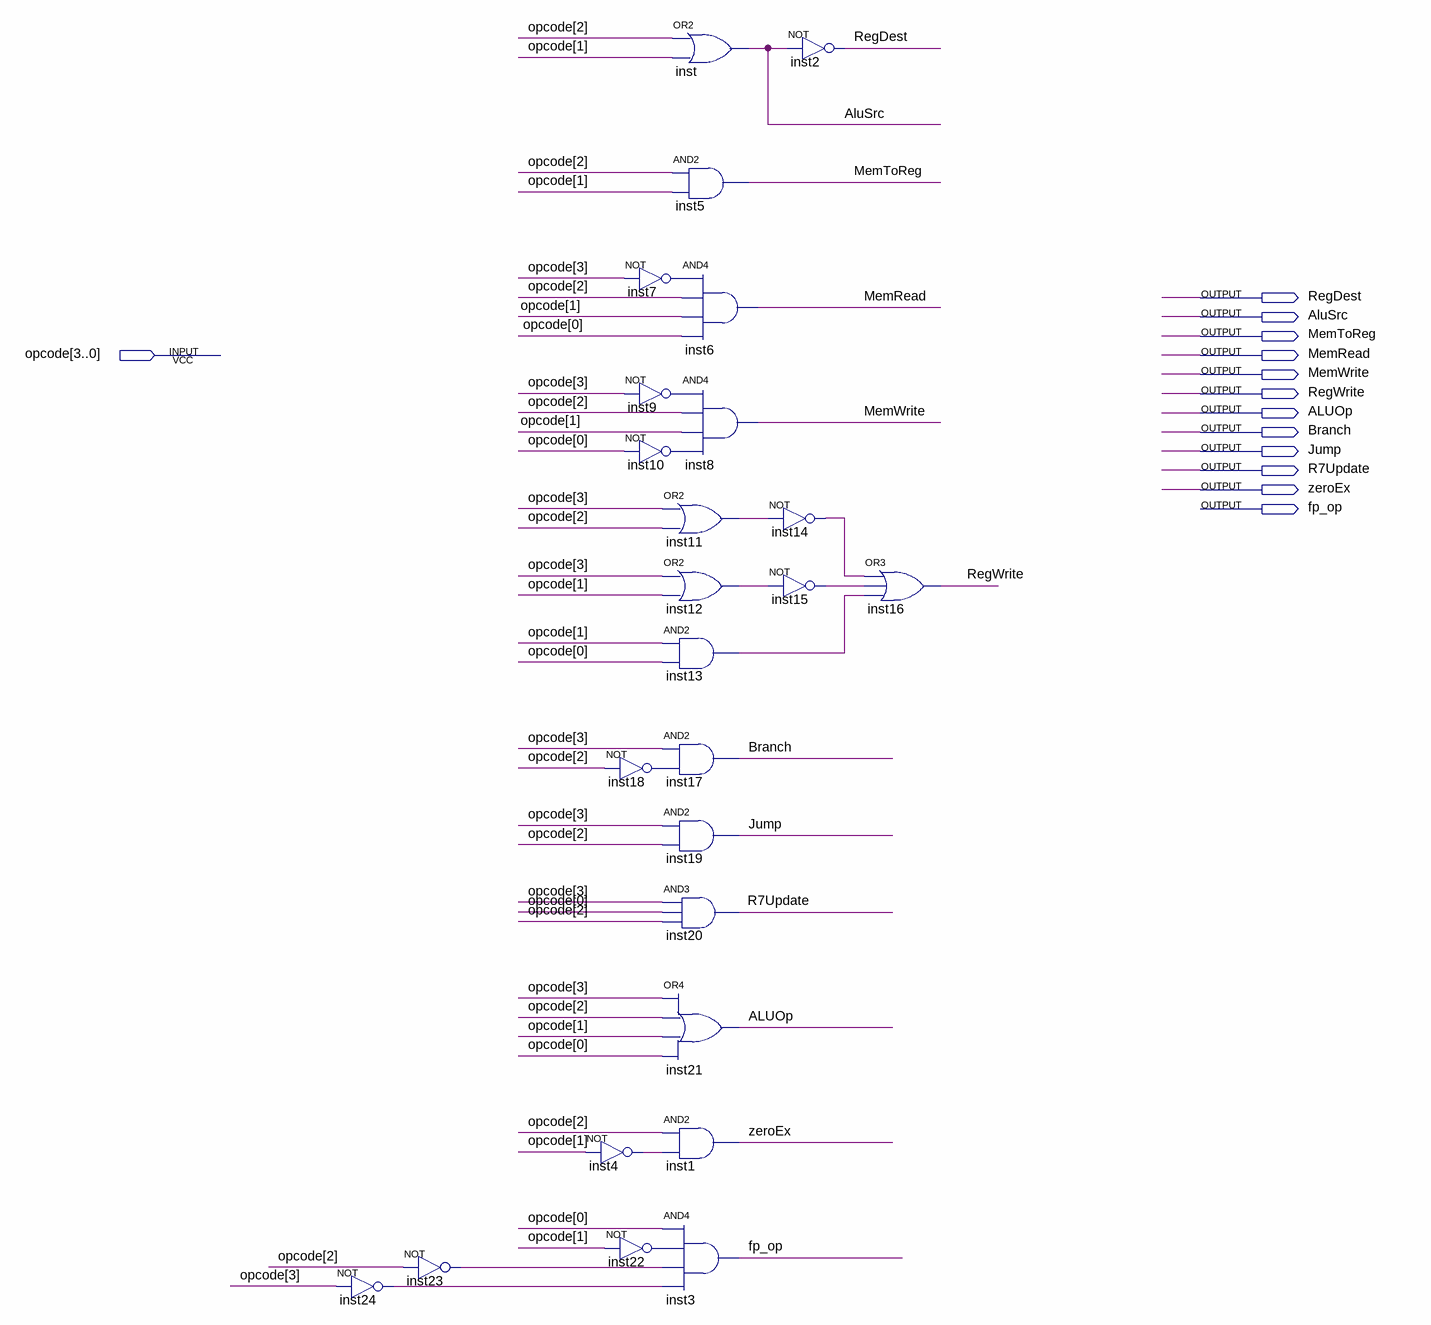
[diagram p0: schematic sheet]
// Quartus schematic main_control.bdf as structural Verilog: 25 symbols, 13 pins
module main_control (
  input  [3:0] opcode,
  output RegDest,
  output AluSrc,
  output MemToReg,
  output MemRead,
  output MemWrite,
  output RegWrite,
  output ALUOp,
  output Branch,
  output Jump,
  output R7Update,
  output zeroEx,
  output fp_op
);

  wire inst4_out, inst7_out, inst9_out, inst10_out, inst11_out, inst12_out, inst13_out, inst14_out,
       inst15_out, inst18_out, inst22_out, inst23_out, inst24_out;

  not inst24 (inst24_out, opcode[3]);
  not inst23 (inst23_out, opcode[2]);
  not inst7 (inst7_out, opcode[3]);
  not inst9 (inst9_out, opcode[3]);
  not inst10 (inst10_out, opcode[0]);
  not inst18 (inst18_out, opcode[2]);
  not inst4 (inst4_out, opcode[1]);
  not inst22 (inst22_out, opcode[1]);
  or inst (AluSrc, opcode[2], opcode[1]);
  and inst5 (MemToReg, opcode[2], opcode[1]);
  and inst6 (MemRead, inst7_out, opcode[2], opcode[1], opcode[0]);
  and inst8 (MemWrite, inst9_out, opcode[2], opcode[1], inst10_out);
  or inst11 (inst11_out, opcode[3], opcode[2]);
  or inst12 (inst12_out, opcode[3], opcode[1]);
  and inst13 (inst13_out, opcode[1], opcode[0]);
  and inst17 (Branch, opcode[3], inst18_out);
  and inst19 (Jump, opcode[3], opcode[2]);
  and inst20 (R7Update, opcode[3], opcode[0], opcode[2]);
  or inst21 (ALUOp, opcode[3], opcode[2], opcode[1], opcode[0]);
  and inst1 (zeroEx, opcode[2], inst4_out);
  and inst3 (fp_op, opcode[0], inst22_out, inst23_out, inst24_out);
  not inst14 (inst14_out, inst11_out);
  not inst15 (inst15_out, inst12_out);
  not inst2 (RegDest, AluSrc);
  or inst16 (RegWrite, inst14_out, inst15_out, inst13_out);
endmodule
